# Altium schematic sheet Flight_Controller_v1.SchDoc (part 2 of 2)
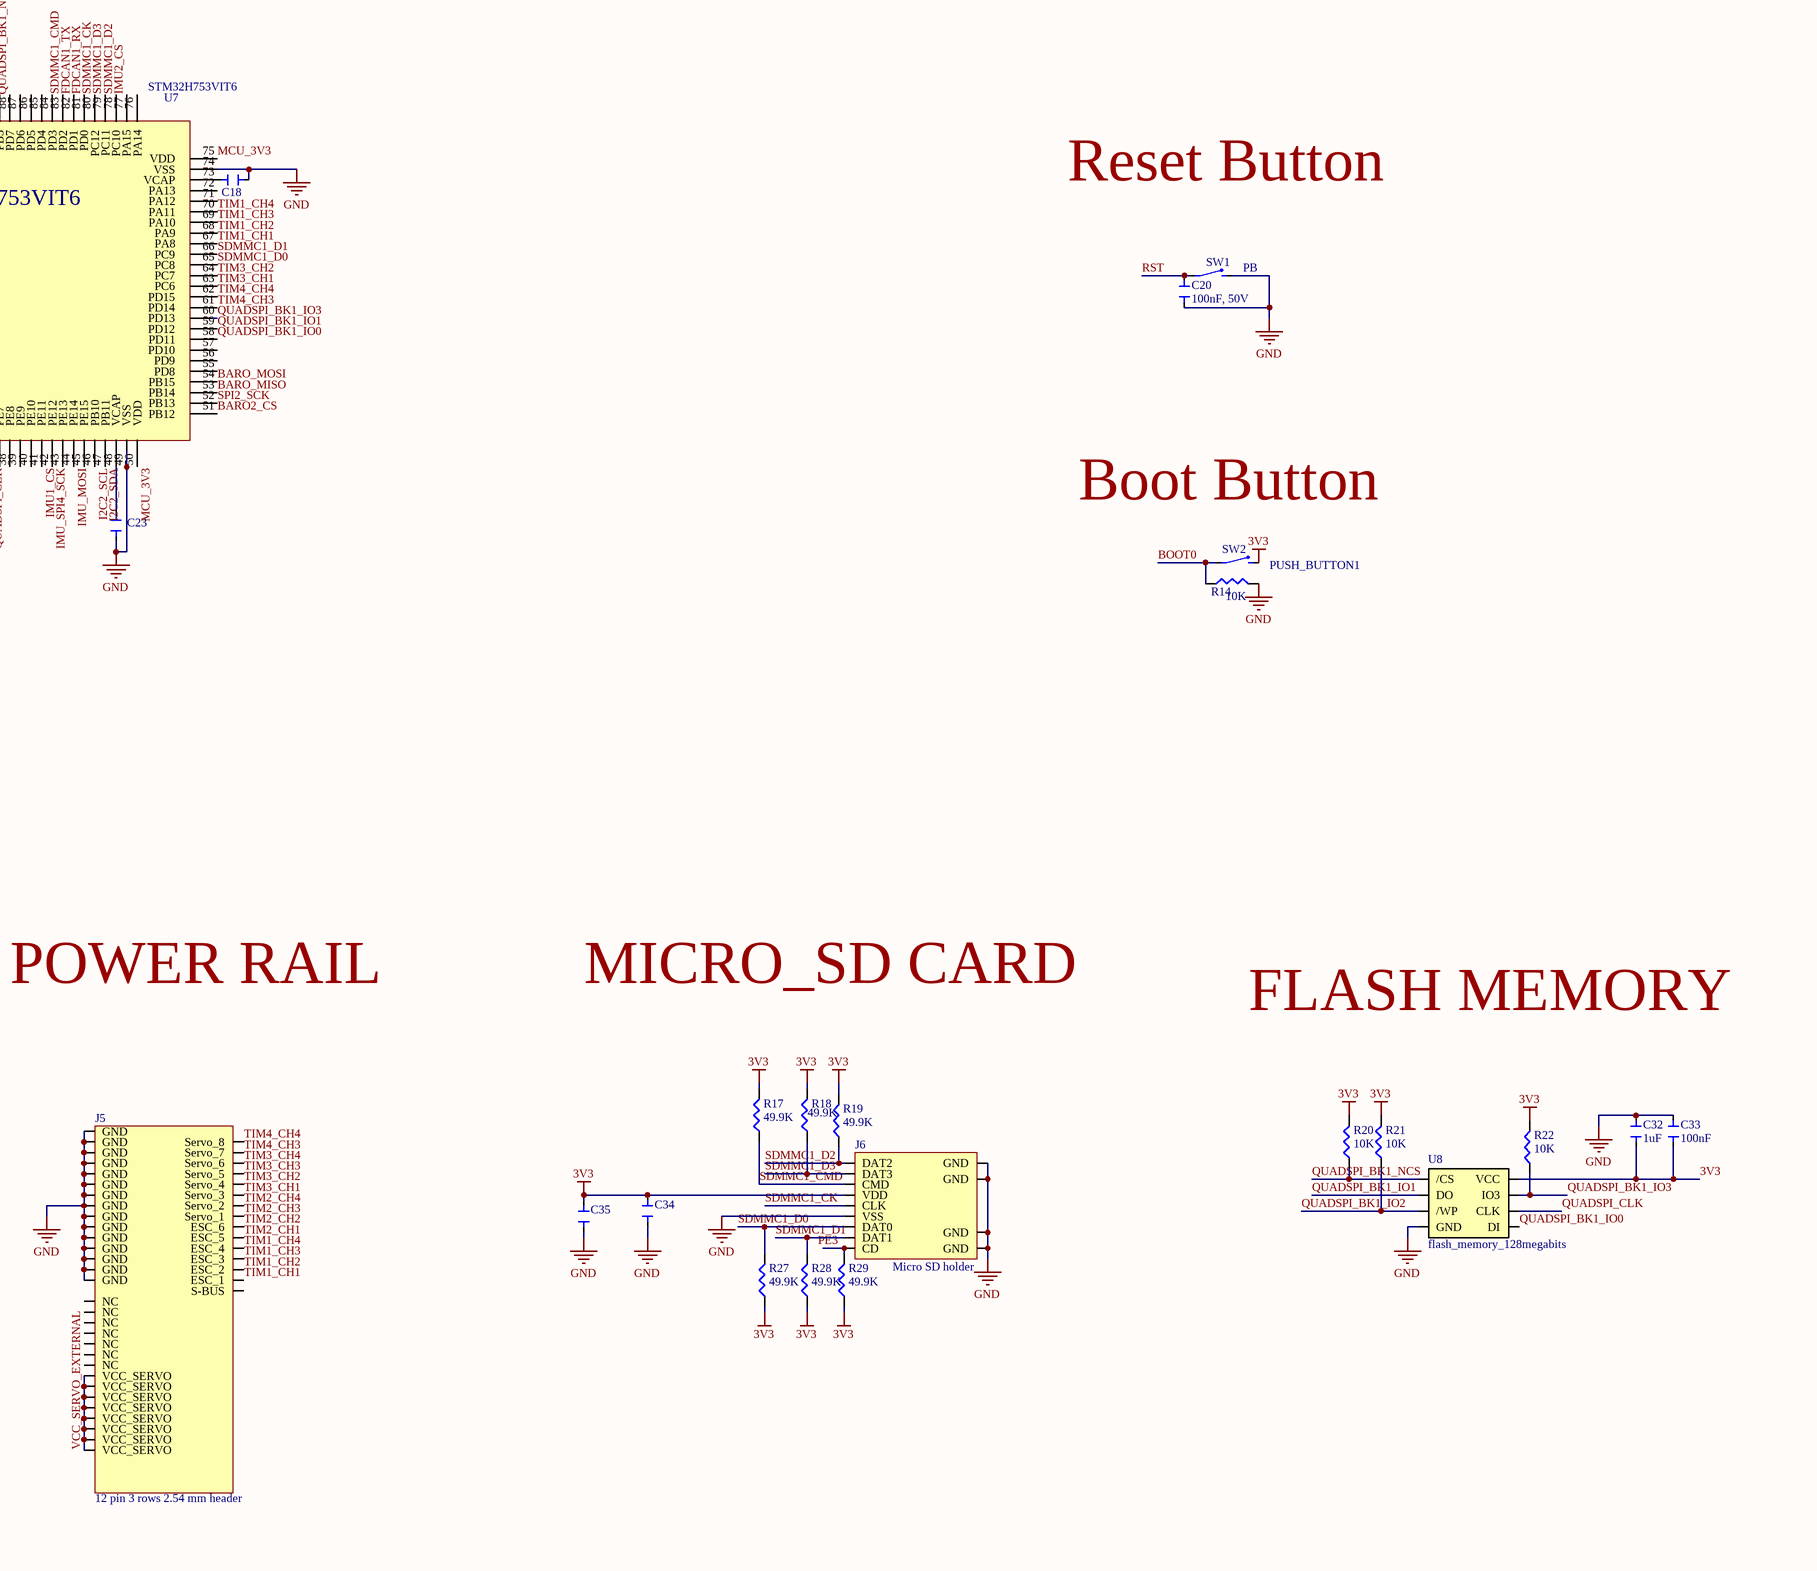
[diagram p4: Flight_Controller_v1.SchDoc, bottom right]

## Library data of the parts
C1 C2 C5-C8 C10-C13 C28 C31 C33 C35-C39 = CAP_100nF: CAP 100nF 50V X7R ±10% 0603 Ceramic Capacitors RoHS; manufacturer: YAGEO; manufacturer part number: CC0603KRX7R9BB104; value: 100nf; supplier: LCSC; supplier part number: C14663; ComponentLink1Description: Datasheet; ComponentLink1URL: https://www.lcsc.com/datasheet/C14663.pdf
C3 C24 C26 C29 = CAP_10uF: CAP 10uF X7R ±10% 1206 Ceramic Capacitors RoHS; manufacturer: TDK; manufacturer part number: CGA5L1X7R1E106K160AC; ComponentLink1Description: Datasheet; ComponentLink1URL: https://www.lcsc.com/datasheet/C2168260.pdf; value: 10uf; supplier: LCSC; supplier part number: C2168260
C4 C16 = CAP_0603_10nf: 10nF ±10% 50V Ceramic Capacitor X7R 0603; ComponentLink1Description: datasheet; ComponentLink1URL: https://www.lcsc.com/product-detail/C100042.html?s_z=n_capacitor%2520%252010nf
C9 C14 C17 C30 C34 = CAP_4.7uF: CAP  4.7uF 25V X7R ±10% 1206 Ceramic Capacitors RoHS; manufacturer: FH; manufacturer part number: 1206B475K250NT; value: 4.7uF; supplier: LCSC; supplier part number: C132148; ComponentLink1Description: Datasheet; ComponentLink1URL: https://www.lcsc.com/product-detail/C132148.html?s_z=n_FH%25201206B475K250N
C15 C25 C27 C40-C43 = CAP_22uF: CAP 22uF 25V X5R ±20% 0805 Ceramic Capacitors RoHS; manufacturer: Samsung Electro-Mechanics; manufacturer part number: CL21A226MAYNNNE; ComponentLink1Description: Datasheet; ComponentLink1URL: https://www.lcsc.com/datasheet/C602037.pdf; Value: 22uF; supplier: LCSC; supplier part number: C602037
C18 C23 = CAP_2.2uF: CAP  2.2uF 25V X7R ±10% 1206 Ceramic Capacitors RoHS; manufacturer: FH; manufacturer part number: 1206B475K250NT; value: 2.2 uF; supplier: LCSC; supplier part number: C132148; ComponentLink1Description: Datasheet; ComponentLink1URL: https://www.lcsc.com/product-detail/C132148.html?s_z=n_FH%25201206B475K250N
C19 C22 = CAP_22pF: 50V 22pF C0G ±5% 0402 Multilayer Ceramic Capacitors MLCC - SMD/SMT ROHS,CAP CER 22pF 50V C0G 0402; Manufacturer: Murata; Manufacturer Part Number: GRM1555C1H220JA01D; Manufacturer Lifecycle Status: NRND; Supplier: Arrow Electronics; Supplier Part Number: GRM1555C1H220JA01D; RoHS: Compliant; Category: Ceramic Capacitors; Stock: 1320000; Pricing: 30000=0.0031 (USD); Value: 22pF; Case/Package: 0402; Case Code (Imperial): 0402; Case Code (Metric): 1005; Depth: 500µm; Dielectric: C0G; Dielectric Material: Ceramic; Height: 500µm; Lead Free: Lead Free; Length: 1mm; Lifecycle Status: NRND; Material: Ceramic; Max Operating Temperature: 125°C; Min Operating Temperature: -55°C; Mounting Technology: Surface Mount; Number of Terminals: 2; Packaging: Cut Tape; Radiation Hardening: No; REACH SVHC: Yes; Schedule B: 8532240020, 8532240020|8532240020|8532240020|8532240020|8532240020; Termination: SMD/SMT; Thickness: 500µm; Tolerance: 5%; Voltage: 50V; Voltage Rating: 50V; Voltage Rating (DC): 50V; Width: 500µm; ComponentLink1URL: https://datasheet.octopart.com:443/GRM1555C1H220JA01D-Murata-datasheet-141913788.pdf?src-supplier=Upverter; ComponentLink1Description: https://datasheet.octopart.com:443/GRM1555C1H220JA01D-Murata-datasheet-141913788.pdf?src-supplier=Upverter; ComponentLink2URL: https://datasheet.octopart.com:443/GRM1555C1H220JA01D-Murata-datasheet-12559435.pdf?src-supplier=element14+APAC; ComponentLink2Description: https://datasheet.octopart.com:443/GRM1555C1H220JA01D-Murata-datasheet-12559435.pdf?src-supplier=element14+APAC; ComponentLink3URL: https://datasheet.octopart.com:443/GRM1555C1H220JA01D-Murata-datasheet-62317060.pdf?src-supplier=element14+APAC; ComponentLink3Description: https://datasheet.octopart.com:443/GRM1555C1H220JA01D-Murata-datasheet-62317060.pdf?src-supplier=element14+APAC; ComponentLink4URL: https://datasheet.octopart.com:443/GRM1555C1H220JA01D-Murata-datasheet-141266224.pdf?src-supplier=Ciiva; ComponentLink4Description: https://datasheet.octopart.com:443/GRM1555C1H220JA01D-Murata-datasheet-141266224.pdf?src-supplier=Ciiva; ComponentLink5URL: https://datasheet.octopart.com:443/GRM1555C1H220JA01D-Murata-datasheet-140681354.pdf?src-supplier=Ciiva; ComponentLink5Description: https://datasheet.octopart.com:443/GRM1555C1H220JA01D-Murata-datasheet-140681354.pdf?src-supplier=Ciiva; ComponentLink6URL: https://datasheet.octopart.com:443/GRM1555C1H220JA01D-Murata-datasheet-138739516.pdf?src-supplier=Ciiva; ComponentLink6Description: https://datasheet.octopart.com:443/GRM1555C1H220JA01D-Murata-datasheet-138739516.pdf?src-supplier=Ciiva; ComponentLink7URL: https://datasheet.octopart.com:443/GRM1555C1H220JA01D-Murata-datasheet-120101189.pdf?src-supplier=Megastar; ComponentLink7Description: https://datasheet.octopart.com:443/GRM1555C1H220JA01D-Murata-datasheet-120101189.pdf?src-supplier=Megastar; ComponentLink8URL: https://datasheet.octopart.com:443/GRM1555C1H220JA01D-Murata-datasheet-81455556.pdf?src-supplier=TME; ComponentLink8Description: https://datasheet.octopart.com:443/GRM1555C1H220JA01D-Murata-datasheet-81455556.pdf?src-supplier=TME; ComponentLink9URL: https://datasheet.octopart.com:443/GRM1555C1H220JA01D-Murata-datasheet-22122223.pdf?src-supplier=Future+Electronics; ComponentLink9Description: https://datasheet.octopart.com:443/GRM1555C1H220JA01D-Murata-datasheet-22122223.pdf?src-supplier=Future+Electronics; ComponentLink10URL: https://datasheet.octopart.com:443/GRM1555C1H220JA01D-Murata-datasheet-12510170.pdf?src-supplier=Future+Electronics; ComponentLink10Description: https://datasheet.octopart.com:443/GRM1555C1H220JA01D-Murata-datasheet-12510170.pdf?src-supplier=Future+Electronics; ComponentLink11URL: https://datasheet.octopart.com:443/GRM1555C1H220JA01D-Murata-datasheet-8517407.pdf?src-supplier=Future+Electronics; ComponentLink11Description: https://datasheet.octopart.com:443/GRM1555C1H220JA01D-Murata-datasheet-8517407.pdf?src-supplier=Future+Electronics; ComponentLink12URL: https://datasheet.octopart.com:443/GRM1555C1H220JA01D-Murata-datasheet-8387045.pdf?src-supplier=Future+Electronics; ComponentLink12Description: https://datasheet.octopart.com:443/GRM1555C1H220JA01D-Murata-datasheet-8387045.pdf?src-supplier=Future+Electronics; ComponentLink13URL: https://datasheet.octopart.com:443/GRM1555C1H220JA01D-Murata-datasheet-8324201.pdf?src-supplier=Future+Electronics; ComponentLink13Description: https://datasheet.octopart.com:443/GRM1555C1H220JA01D-Murata-datasheet-8324201.pdf?src-supplier=Future+Electronics; ComponentLink14URL: https://datasheet.octopart.com:443/GRM1555C1H220JA01D-Murata-datasheet-7628724.pdf?src-supplier=Future+Electronics; ComponentLink14Description: https://datasheet.octopart.com:443/GRM1555C1H220JA01D-Murata-datasheet-7628724.pdf?src-supplier=Future+Electronics; ComponentLink15URL: https://datasheet.octopart.com:443/GRM1555C1H220JA01D-Murata-datasheet-552801.pdf?src-supplier=Future+Electronics; ComponentLink15Description: https://datasheet.octopart.com:443/GRM1555C1H220JA01D-Murata-datasheet-552801.pdf?src-supplier=Future+Electronics; ComponentLink16URL: https://datasheet.octopart.com:443/GRM1555C1H220JA01D-Murata-datasheet-44781475.pdf?src-supplier=Future+Electronics; ComponentLink16Description: https://datasheet.octopart.com:443/GRM1555C1H220JA01D-Murata-datasheet-44781475.pdf?src-supplier=Future+Electronics; ComponentLink17URL: https://datasheet.octopart.com/GRM1555C1H220JA01D-Murata-datasheet-12515295.pdf; ComponentLink17Description: https://datasheet.octopart.com/GRM1555C1H220JA01D-Murata-datasheet-12515295.pdf; ComponentLink18URL: https://datasheet.octopart.com/GRM1555C1H220JA01D-Murata-datasheet-12510076.pdf; ComponentLink18Description: https://datasheet.octopart.com/GRM1555C1H220JA01D-Murata-datasheet-12510076.pdf; ComponentLink19URL: https://datasheet.octopart.com/GRM1555C1H220JA01D-Murata-datasheet-11978611.pdf; ComponentLink19Description: https://datasheet.octopart.com/GRM1555C1H220JA01D-Murata-datasheet-11978611.pdf; ComponentLink20URL: https://datasheet.octopart.com/GRM1555C1H220JA01D-Murata-datasheet-10025737.pdf; ComponentLink20Description: https://datasheet.octopart.com/GRM1555C1H220JA01D-Murata-datasheet-10025737.pdf; ComponentLink21URL: https://datasheet.octopart.com/GRM1555C1H220JA01D-Murata-datasheet-8819587.pdf; ComponentLink21Description: https://datasheet.octopart.com/GRM1555C1H220JA01D-Murata-datasheet-8819587.pdf; ComponentLink22URL: https://datasheet.octopart.com/GRM1555C1H220JA01D-Murata-datasheet-14396388.pdf; ComponentLink22Description: https://datasheet.octopart.com/GRM1555C1H220JA01D-Murata-datasheet-14396388.pdf; ComponentLink23URL: http://sigma.octopart.com:80/reach_statement/Murata-company-16.pdf?src-supplier=Compliance+Statements; ComponentLink23Description: http://sigma.octopart.com:80/reach_statement/Murata-company-16.pdf?src-supplier=Compliance+Statements
C20 = CAP_0402_0.1UF: CAP CER 0.1UF 50V X7R 0402; Manufacturer: Samsung Electro-Mechanics; Manufacturer Part Number: CL05B104KB54PNC; Dielectric Material: Ceramic; Supplier: LCSC; Supplier Part Number: C307331; RoHS: Yes; Category: Ceramic Capacitors; Stock: 1237875; Pricing: 1=0.1, 10=0.044, 50=0.025, 100=0.0194, 500=0.0146, 1000=0.01147, 2500=0.01043, 5000=0.00959 (USD); Pins: 2; Capacitor Type: Ceramic; RoHS Compliant: Yes; Reach SVHC Compliant: Yes; ComponentLink1URL: https://datasheet.ciiva.com:443/pdfs/VipMasterIC/IC/SEMS/SEMS-S-A0006318249/SEMS-S-A0006320959-1.pdf?src-supplier=IHS+Markit; ComponentLink1Description: https://datasheet.ciiva.com:443/pdfs/VipMasterIC/IC/SEMS/SEMS-S-A0006318249/SEMS-S-A0006320959-1.pdf?src-supplier=IHS+Markit; ComponentLink2URL: https://datasheet.octopart.com/CL05B104KB54PNC-Samsung-datasheet-8326407.pdf?src-supplier=TME; ComponentLink2Description: https://datasheet.octopart.com/CL05B104KB54PNC-Samsung-datasheet-8326407.pdf?src-supplier=TME; LCSC Part Number: C307331
C21 = E3SB25E001803E: Crystal 25.0000MHZ 12PF SMD; Manufacturer: Hosonic Electronic; Supplier: DigiKey; Supplier Part Number: 3186-E3SB25E001803ECT-ND; Manufacturer Part Number: E3SB25E001803E; Category: Crystals; Stock: 2953; Pricing: 1=0.34, 10=0.299, 25=0.2824, 50=0.2706, 100=0.2595, 250=0.24536, 500=0.23522, 1000=0.22549 (USD)
C32 = CAP_1uF: CAP  1uF 25V X7R ±10% 1206 Ceramic Capacitors RoHS; manufacturer: FH; manufacturer part number: 1206B475K250NT; value: 2.2 uF; supplier: LCSC; supplier part number: C132148; ComponentLink1Description: Datasheet; ComponentLink1URL: https://www.lcsc.com/product-detail/C132148.html?s_z=n_FH%25201206B475K250N
D1 = ESD5Z5.0: SOD-523 ESD Protection Devices ROHS; Manufacturer: Anbon; Supplier: LCSC; Supplier Part Number: C397782; Manufacturer Part Number: ESD5Z5.0; Category: Uncategorized; Stock: 3000; Pricing: 20=0.0229, 200=0.018, 600=0.0153, 3000=0.012, 9000=0.0106, 21000=0.0099 (USD)
D2 = TVS-bidirectional-Diode: 48.4VC Clamp 4.1A Ipp TVS DIODE SOD-123F; Manufacturer: Littelfuse; Manufacturer Part Number: SMF30CA; Supplier: LCSC; Supplier Part Number: C3720992
D3 = Schottky_40v_3A: Rectifier Diode, Schottky, 1 Phase, 1 Element, 3A, 40V V(RRM), Silicon, DO-214AB; Manufacturer: Vishay; Manufacturer Part Number: SS34-E3/9AT; Element Configuration: Single; Forward Voltage: 500mV; Max Forward Surge Current (Ifsm): 100A; Max Junction Temperature (Tj): 150°C; Max Reverse Leakage Current: 500µA; Number of Elements: 1; Supplier: DigiKey; Supplier Part Number: SS34-E3/9ATGICT-ND; RoHS: Compliant; Category: Rectifier Diodes; Stock: 17685; Pricing: 1=0.78, 10=0.459, 100=0.3295, 500=0.25386, 1000=0.22717 (USD); Average Rectified Current: 3A; Case/Package: SMC; China RoHS: Non-Compliant; Forward Current: 3A; Height: 2.62mm; Lifecycle Status: Production; Max Operating Temperature: 150°C; Max Output current: 3A; Max Repetitive Reverse Voltage (Vrrm): 40V; Max Reverse Voltage (DC): 40V; Max Surge Current: 100A; Min Operating Temperature: -55°C; Mounting Technology: Surface Mount; Pins: 2; Number of Terminals: 2; Peak Non-Repetitive Surge Current: 100A; Peak Reverse Current: 500µA; Radiation Hardening: No; REACH SVHC: No; Reverse Standoff Voltage: 40V; Reverse Voltage: 40V; Schedule B: 8541100080, 8541100080|8541100080|8541100080|8541100080|8541100080; ComponentLink1URL: https://datasheet.octopart.com:443/SS34-E3-9AT-Vishay-datasheet-181475108.pdf?src-supplier=IHS; ComponentLink1Description: https://datasheet.octopart.com:443/SS34-E3-9AT-Vishay-datasheet-181475108.pdf?src-supplier=IHS; ComponentLink2URL: https://datasheet.octopart.com:443/SS34-E3-9AT-Vishay-datasheet-138899081.pdf?src-supplier=Upverter; ComponentLink2Description: https://datasheet.octopart.com:443/SS34-E3-9AT-Vishay-datasheet-138899081.pdf?src-supplier=Upverter; ComponentLink3URL: https://datasheet.octopart.com:443/SS34-E3-9AT-Vishay-datasheet-188933186.pdf?src-supplier=TME; ComponentLink3Description: https://datasheet.octopart.com:443/SS34-E3-9AT-Vishay-datasheet-188933186.pdf?src-supplier=TME; ComponentLink4URL: https://datasheet.octopart.com:443/SS34-E3-9AT-Vishay-datasheet-15599040.pdf?src-supplier=Future+Electronics; ComponentLink4Description: https://datasheet.octopart.com:443/SS34-E3-9AT-Vishay-datasheet-15599040.pdf?src-supplier=Future+Electronics; ComponentLink5URL: https://datasheet.octopart.com:443/SS34-E3/9AT-Vishay-datasheet-11610764.pdf?src-supplier=Arrow+Electronics; ComponentLink5Description: https://datasheet.octopart.com:443/SS34-E3/9AT-Vishay-datasheet-11610764.pdf?src-supplier=Arrow+Electronics; ComponentLink6URL: http://sigma.octopart.com:80/rohs_statement/Vishay-company-15.pdf?src-supplier=Compliance+Statements; ComponentLink6Description: http://sigma.octopart.com:80/rohs_statement/Vishay-company-15.pdf?src-supplier=Compliance+Statements
D4-D6 = AQ3045-01ETG: TVS DIODE 5.3VWM 12VC SOD882; Manufacturer: Littelfuse; Diode Element Material: SILICON; Package Body Material: Plastic; Polarity: Bidirectional; Max Breakdown Voltage: 9V; Min Breakdown Voltage: 6.8V; Diode Type: TRANS VOLTAGE SUPPRESSOR; Non-rep Peak Rev Power Dis-Max: 40W; Number of Elements: 1; Rep Pk Reverse Voltage-Max: 5.3V; Reference Standard: AEC-Q101; Supplier: Digikey; Supplier Part Number: F9321CT-ND; Manufacturer Part Number: AQ3045-01ETG; RoHS: Yes; Category: TVS Diodes; Stock: 21664; Pricing: 1=0.5, 10=0.391, 100=0.2344, 500=0.217, 1000=0.14756, 2000=0.13585, 5000=0.1302 (USD); Pins: 2; Package Shape: Rectangular; Min Operating Temperature: -55°C; Max Operating Temperature: 150°C; Package Style: CHIP CARRIERMeter; Surface Mount: Yes; Technology: AVALANCHE; Terminal Form: No Lead; Terminal Position: BOTTOM; Reach SVHC Compliant: Yes; RoHS Compliant: Yes; ComponentLink1URL: https://datasheet.ciiva.com:443/pdfs/VipMasterIC/IC/LFSI/LFSI-S-A0007892042/LFSI-S-A0007892042-1.pdf?src-supplier=IHS+Markit; ComponentLink1Description: https://datasheet.ciiva.com:443/pdfs/VipMasterIC/IC/LFSI/LFSI-S-A0007892042/LFSI-S-A0007892042-1.pdf?src-supplier=IHS+Markit; ComponentLink2URL: https://www.littelfuse.com/~/media/electronics/datasheets/tvs_diode_arrays/littelfuse_tvs_diode_array_aq3045_datasheet.pdf.pdf?src-supplier=Digikey; ComponentLink2Description: https://www.littelfuse.com/~/media/electronics/datasheets/tvs_diode_arrays/littelfuse_tvs_diode_array_aq3045_datasheet.pdf.pdf?src-supplier=Digikey; ComponentLink3URL: http://www.littelfuse.com/~/media/electronics/datasheets/tvs_diode_arrays/littelfuse_tvs_diode_array_aq3045_datasheet.pdf.pdf?src-supplier=Digikey; ComponentLink3Description: http://www.littelfuse.com/~/media/electronics/datasheets/tvs_diode_arrays/littelfuse_tvs_diode_array_aq3045_datasheet.pdf.pdf?src-supplier=Digikey; LCSC Part Number: C3710326
F1 = 0451020.MRL: 125V 3A 2410 Fuses RoHS; Manufacturer: Littelfuse; Fuse Interrupt Ac Current: 50A; Fuse I2T: 1.65A2Sec; Fuse Blow Speed: Fast; Voltage Rating: 125V; LCSC link: https://www.lcsc.com/product-detail/C13982.html?s_z=n_0451003.MRL; Max Fuse Dc Voltage: 125V; Mouser Description: Surface Mount Fuses 125V 3A; Package: 0451; Device Class L2: Fuses; Fuse Current: 3A; Manufacturer Part Number: 0451020.MRL; ComponentLink2Description: Datasheet; Lead Free: Yes; Temperature Range Low: -55°C; Max Fuse Ac Voltage: 125V; Temperature: -55°C to +125°C; Device Class L1: Circuit Protection; Octopart: https://octopart.com/0451003.mrl-littelfuse-566380; Category: Fuse; Height: 2.94mm; Temperature Range High: +125°C; Supplier Part Number: C178980; ComponentLink2URL: https://www.littelfuse.com/~/media/electronics/datasheets/fuses/littelfuse_fuse_451_453_datasheet.pdf.pdf; Digikey Description: FUSE BRD MNT 3A 125VAC/VDC 2SMD; Device Class L3: unset; Supplier: LCSC; Fuse Interrupt Dc Current: 50A; LCSC Part: C13982; Datasheet Link: https://www.lcsc.com/datasheet/C178980.pdf
I1 I2 = BLM18SG121TN1D: Ferrite Beads Multi-Layer 120Ohm 25% 10Kyocera KNH16C104DA5TS EMI filter0MHz 3A 0.025Ohm DCR 0603 T/R; Manufacturer: Murata; Current Rating: 1A; DC Resistance (DCR): 25mΩ; Frequency: 100MHz; Impedance: 120Ω; Number of Circuits: 1; Value: 25mΩ; Shielding: Unshielded; Supplier: Arrow Electronics; Supplier Part Number: C107332; Manufacturer Part Number: BLM18SG121TN1D; RoHS: Compliant; Category: Ferrite Beads and Chips; Stock: 330000; Pricing: 10000=0.0271 (USD); Case/Package: 0603; Case Code (Imperial): 0603; Case Code (Metric): 1608; Contact Plating: Tin; Core Material: Ferrite; Depth: 800µm; Height: 500µm; Lead Free: Lead Free; Length: 1.6mm; Lifecycle Status: Production; Material: Ferrite, Steel; Max Current Rating: 3A; Max DC Current: 3A; Clock Frequency: 100MHz; Max Operating Temperature: 125°C; Min Operating Temperature: -55°C; Number of Lines: 1; Pins: 2; Number of Terminals: 2; Packaging: Cut Tape; REACH SVHC: Yes; RMS Current (Irms): 3A; Schedule B: 8504500000, 8504500000|8504500000|8504500000|8504500000|8504500000; ESR: 25mΩ; Termination: SMD/SMT; Test Frequency: 100MHz; Tolerance: 25%; Width: 800µm; ComponentLink1URL: https://datasheet.octopart.com:443/BLM18SG121TN1D-Murata-datasheet-180806579.pdf?src-supplier=IHS; ComponentLink1Description: https://datasheet.octopart.com:443/BLM18SG121TN1D-Murata-datasheet-180806579.pdf?src-supplier=IHS; ComponentLink2URL: https://datasheet.octopart.com:443/BLM18SG121TN1D-Murata-datasheet-37129980.pdf?src-supplier=element14+APAC; ComponentLink2Description: https://datasheet.octopart.com:443/BLM18SG121TN1D-Murata-datasheet-37129980.pdf?src-supplier=element14+APAC; ComponentLink3URL: https://datasheet.octopart.com:443/BLM18SG121TN1D-Murata-datasheet-168152.pdf?src-supplier=element14+APAC; ComponentLink3Description: https://datasheet.octopart.com:443/BLM18SG121TN1D-Murata-datasheet-168152.pdf?src-supplier=element14+APAC; ComponentLink4URL: https://datasheet.octopart.com:443/BLM18SG121TN1D-Murata-datasheet-11549175.pdf?src-supplier=_legacy+Avnet; ComponentLink4Description: https://datasheet.octopart.com:443/BLM18SG121TN1D-Murata-datasheet-11549175.pdf?src-supplier=_legacy+Avnet; ComponentLink5URL: https://datasheet.octopart.com:443/BLM18SG121TN1D-Murata-datasheet-55943.pdf?src-supplier=DigiKey; ComponentLink5Description: https://datasheet.octopart.com:443/BLM18SG121TN1D-Murata-datasheet-55943.pdf?src-supplier=DigiKey; ComponentLink6URL: https://datasheet.octopart.com:443/BLM18SG121TN1D-Murata-datasheet-141258064.pdf?src-supplier=Ciiva; ComponentLink6Description: https://datasheet.octopart.com:443/BLM18SG121TN1D-Murata-datasheet-141258064.pdf?src-supplier=Ciiva; ComponentLink7URL: https://datasheet.octopart.com:443/BLM18SG121TN1D-Murata-datasheet-138707216.pdf?src-supplier=Ciiva; ComponentLink7Description: https://datasheet.octopart.com:443/BLM18SG121TN1D-Murata-datasheet-138707216.pdf?src-supplier=Ciiva; ComponentLink8URL: https://datasheet.octopart.com:443/BLM18SG121TN1D-Murata-datasheet-135086704.pdf?src-supplier=TME; ComponentLink8Description: https://datasheet.octopart.com:443/BLM18SG121TN1D-Murata-datasheet-135086704.pdf?src-supplier=TME; ComponentLink9URL: https://datasheet.octopart.com:443/BLM18SG121TN1D-Murata-datasheet-62086350.pdf?src-supplier=Future+Electronics; ComponentLink9Description: https://datasheet.octopart.com:443/BLM18SG121TN1D-Murata-datasheet-62086350.pdf?src-supplier=Future+Electronics; ComponentLink10URL: https://datasheet.octopart.com:443/BLM18SG121TN1D-Murata-datasheet-12522583.pdf?src-supplier=Newark; ComponentLink10Description: https://datasheet.octopart.com:443/BLM18SG121TN1D-Murata-datasheet-12522583.pdf?src-supplier=Newark; ComponentLink11URL: https://datasheet.octopart.com:443/BLM18SG121TN1D-Murata-datasheet-10083551.pdf?src-supplier=Newark; ComponentLink11Description: https://datasheet.octopart.com:443/BLM18SG121TN1D-Murata-datasheet-10083551.pdf?src-supplier=Newark; ComponentLink12URL: https://datasheet.octopart.com:443/BLM18SG121TN1D-Murata-datasheet-8508678.pdf?src-supplier=Newark; ComponentLink12Description: https://datasheet.octopart.com:443/BLM18SG121TN1D-Murata-datasheet-8508678.pdf?src-supplier=Newark; ComponentLink13URL: http://sigma.octopart.com:80/reach_statement/Murata-company-16.pdf?src-supplier=Compliance+Statements; ComponentLink13Description: http://sigma.octopart.com:80/reach_statement/Murata-company-16.pdf?src-supplier=Compliance+Statements
J1 = XT30PW-M: Manufacturer: Changzhou Amass Elec; Manufacturer Part Number: XT30U-M; Supplier: LCSC; Supplier Part Number: C99101; Datasheet Link: https://www.lcsc.com/datasheet/C99101.pdf
J4 = USB_C: USB Connector, USB Type C, USB 2.0, Receptacle, 16 Ways, Surface Mount, Through Hole Mount; Manufacturer: Molex; Manufacturer Part Number: 217179-0001; Contact Resistance: 50mΩ; Current Rating: 1.25A; Dielectric Material: Polyamide; Insulation Resistance: 100MΩ; Number of Contacts: 16; Number of Ports: 1; USB Standard: USB 2.0; Voltage Rating: 30V; Supplier: LCSC; Supplier Part Number: C3197684; RoHS: Compliant; Category: USB Connectors; Stock: 3219; Pricing: 1=0.6714, 10=0.617, 25=0.573, 50=0.562, 100=0.534, 250=0.511, 500=0.477, 1200=0.432, 2400=0.399 (USD); Contact Gender: Female; Contact Material: Gold, Nickel; Gender: Receptacle; Height: 3.36mm; Lifecycle Status: Production; Max Operating Temperature: 85°C; Min Operating Temperature: -40°C; Pins: 16; Number of Rows: 1; REACH SVHC: Yes; Shell Finish: Nickel; Shell Material: Stainless Steel; Terminal Pitch: 500µm; ComponentLink1URL: https://datasheet.octopart.com:443/217179-0001-Molex-datasheet-158871109.pdf?src-supplier=ODG+(Origin+Data+Global); ComponentLink1Description: https://datasheet.octopart.com:443/217179-0001-Molex-datasheet-158871109.pdf?src-supplier=ODG+(Origin+Data+Global); ComponentLink2URL: https://sigma.octopart.com:443/158871110/technical_drawing/Molex-217179-0001.pdf?src-supplier=Upverter; ComponentLink2Description: https://sigma.octopart.com:443/158871110/technical_drawing/Molex-217179-0001.pdf?src-supplier=Upverter; ComponentLink3URL: https://datasheet.octopart.com:443/217179-0001-Molex-datasheet-164573281.pdf?src-supplier=RS+(Formerly+Allied+Electronics); ComponentLink3Description: https://datasheet.octopart.com:443/217179-0001-Molex-datasheet-164573281.pdf?src-supplier=RS+(Formerly+Allied+Electronics); ComponentLink4URL: http://sigma.octopart.com:80/reach_statement/Molex-company-74.pdf?src-supplier=Compliance+Statements; ComponentLink4Description: http://sigma.octopart.com:80/reach_statement/Molex-company-74.pdf?src-supplier=Compliance+Statements; ComponentLink5URL: http://sigma.octopart.com:80/rohs_statement/Molex-company-73.pdf?src-supplier=Compliance+Statements; ComponentLink5Description: http://sigma.octopart.com:80/rohs_statement/Molex-company-73.pdf?src-supplier=Compliance+Statements; ComponentLink6URL: http://sigma.octopart.com:80/conflict_mineral_statement/Molex-company-72.pdf?src-supplier=Compliance+Statements; ComponentLink6Description: http://sigma.octopart.com:80/conflict_mineral_statement/Molex-company-72.pdf?src-supplier=Compliance+Statements; LCSC NUMBER: C3197684
J5 = servo_pwr_rail_1: Pin Header, Board-to-Board, 2.54 mm, 3 Rows, 45 Contacts, Through Hole Right Angle, TSW Series; Manufacturer: Samtec; Manufacturer Part Number: TSW-115-08-G-T-RA; Manufacturer Lifecycle Status: PRODUCTION; Gender: Male; Max Current Rating: 7.6A; Max Voltage Rating (AC): 450V; Number of Contacts: 45; Pitch: 2.54mm; Supplier: LCSC; Supplier Part Number: C374878; RoHS: Compliant; Category: Headers and Wire Housings; Stock: 30; Pricing: 1=61.0933, 1=6.6606, 1=7.6558, 1=55.8108, 10=52.5507, 10=5.7293, 10=48.0069, 10=6.5853, 30=5.1613, 30=47.3414, 30=43.248, 30=5.9325, 100=39.256, 100=4.6849, 100=42.9715, 100=5.3849 (HKD); Contact Material: Bronze; Contact Plating: Gold, Tin; Depth: 14.98mm; Housing Color: Black; Housing Material: Polyester; Lead Pitch: 2.54mm; Length: 38.1mm; Lifecycle Status: Production; Max Operating Temperature: 125°C; Min Operating Temperature: -55°C; Number of Rows: 3; Orientation: Right Angle; Packaging: Bulk; REACH SVHC: No; Termination: Solder; ComponentLink1URL: https://sigma.octopart.com:443/97325577/technical_drawing/Samtec-TSW-115-08-G-T-RA.pdf?src-supplier=Samtec; ComponentLink1Description: https://sigma.octopart.com:443/97325577/technical_drawing/Samtec-TSW-115-08-G-T-RA.pdf?src-supplier=Samtec; ComponentLink2URL: https://datasheet.octopart.com:443/TSW-115-08-G-T-RA-Samtec-datasheet-150856372.pdf?src-supplier=Electro+Sonic; ComponentLink2Description: https://datasheet.octopart.com:443/TSW-115-08-G-T-RA-Samtec-datasheet-150856372.pdf?src-supplier=Electro+Sonic; ComponentLink3URL: https://datasheet.octopart.com:443/TSW-115-08-G-T-RA-Samtec-datasheet-136646178.pdf?src-supplier=Electro+Sonic; ComponentLink3Description: https://datasheet.octopart.com:443/TSW-115-08-G-T-RA-Samtec-datasheet-136646178.pdf?src-supplier=Electro+Sonic; ComponentLink4URL: https://datasheet.octopart.com:443/TSW-115-08-G-T-RA-Samtec-datasheet-62107121.pdf?src-supplier=Farnell; ComponentLink4Description: https://datasheet.octopart.com:443/TSW-115-08-G-T-RA-Samtec-datasheet-62107121.pdf?src-supplier=Farnell; ComponentLink5URL: https://datasheet.octopart.com:443/TSW-115-08-G-T-RA-Samtec-datasheet-180258786.pdf?src-supplier=JRH+Electronics; ComponentLink5Description: https://datasheet.octopart.com:443/TSW-115-08-G-T-RA-Samtec-datasheet-180258786.pdf?src-supplier=JRH+Electronics; ComponentLink6URL: https://datasheet.octopart.com:443/TSW-115-08-G-T-RA-Samtec-datasheet-151455181.pdf?src-supplier=Sager+Electronics; ComponentLink6Description: https://datasheet.octopart.com:443/TSW-115-08-G-T-RA-Samtec-datasheet-151455181.pdf?src-supplier=Sager+Electronics; ComponentLink7URL: https://datasheet.octopart.com/TSW-115-08-G-T-RA-Samtec-datasheet-86818365.pdf; ComponentLink7Description: https://datasheet.octopart.com/TSW-115-08-G-T-RA-Samtec-datasheet-86818365.pdf; ComponentLink8URL: https://datasheet.octopart.com:443/TSW-115-08-G-T-RA-Samtec-datasheet-11047283.pdf?src-supplier=Newark; ComponentLink8Description: https://datasheet.octopart.com:443/TSW-115-08-G-T-RA-Samtec-datasheet-11047283.pdf?src-supplier=Newark
J6 = TF-CARD H1.8 SY: -40⊥~+70⊥ 2mm Gold Card Slot MicroSD card (TF card) Copper alloy Self-bouncing SMD SD Card / Memory Card Connector ROHS; Manufacturer: SHOU HAN; Supplier: LCSC; Supplier Part Number: C7529391; Manufacturer Part Number: TF-CARD H1.8 SY; Category: Memory Cards; Stock: 12390; Pricing: 10=0.483, 10=0.4412, 10=0.0606, 10=0.0528, 100=0.3471, 100=0.0476, 100=0.3799, 100=0.0415, 300=0.3291, 300=0.3006, 300=0.036, 300=0.0413, 1000=0.273, 1000=0.0326, 1000=0.0375, 1000=0.2988, 5000=0.2677, 5000=0.0293, 5000=0.2446, 5000=0.0336, 10000=0.2526, 10000=0.2307, 10000=0.0276, 10000=0.0317 (HKD)
L1 = IND_12.3_22uH: 22uH Magnetic Shielded Inductor 7A SMD,12.3x12.3mm Fixed Inductors RoHS
P1 P2 P4 P5 = JST_GH_V4: BM04B-GHS-TBT; Supplier 1: Digi-Key
P3 = JST_GH_V3: BM03B-GHS-TBT; Supplier 1: Digi-Key
Q1 = AO4407A: 3.1W 38mΩ@5V,10A SOIC-8 Single FETs, MOSFETs RoHS; SnapEDA_Link: https://www.snapeda.com/parts/AO4407A/Alpha/view-part/?ref=snap; Package: SOIC-8; LCSC Link: https://www.lcsc.com/product-detail/C16072.html?s_z=n_AO4407A; LCSC Part: C16072; MP: AO4407A
R1 R2 = RES_0603_3.9K: Resistor, / 100mW 3.9kΩ 75V ±100ppm/℃ Thick Film Resistor ±1% 0603 Chip Resistor - Surface Mount RoHS; manufacturer: UNI-ROYAL; Manufacturer part number: 0603WAF3901T5E; ComponentLink1Description: Datasheet; ComponentLink1URL: https://www.lcsc.com/datasheet/C23018.pdf; value: 3.9k; supplier: LCSC; supplier part number: C23018
R3 R15 R16 R23 R26 = RES_0402_0R: RES 0 OHM JUMPER 1/16W 0402; Manufacturer: Yageo; Manufacturer Part Number: RC0402JR-070RL; Power: 62.5mW; Rated Temperature: 70°C; Package Height: 0.35mm; Package Length: 1mm; Package Width: 0.5mm; Supplier: LCSC; Supplier Part Number: C60485; RoHS: Yes; Category: Chip SMD Resistors; Stock: 5988729; Pricing: 1=0.1, 10=0.011, 25=0.0084, 50=0.0064, 100=0.0045, 250=0.00364, 500=0.0029, 1000=0.00214, 5000=0.00154 (USD); Mounting Technology: Surface Mount; Pins: 2; Package Shape: Rectangular; Case/Package: 0402; Terminal Finish: Nickel; Min Operating Temperature: -55°C; Max Operating Temperature: 155°C; JESD-609 Code: e3; Resistor Type: FIXED RESISTOR; Construction: Chip; Package Style: SMTMeter; Packaging: Tape and Reel; Value: 0R; Technology: METAL GLAZE/THICK FILM; Termination: Wraparound; Reach SVHC Compliant: Yes; RoHS Compliant: Yes; ComponentLink1URL: https://datasheet.ciiva.com:443/pdfs/VipMasterIC/IC/YAGO/YAGO-S-A0008145938/YAGO-S-A0008145938-1.pdf?src-supplier=IHS+Markit; ComponentLink1Description: https://datasheet.ciiva.com:443/pdfs/VipMasterIC/IC/YAGO/YAGO-S-A0008145938/YAGO-S-A0008145938-1.pdf?src-supplier=IHS+Markit; LCSC Part Number: C60485
R4 R14 R20-R22 R30 R34 = RES_0402_10K: RES SMD 10K OHM 1% 1/16W 0402; Manufacturer: Yageo; Manufacturer Part Number: AC0402FR-0710KL; Additional Feature: LASER TRIMMABLE; Power: 62.5mW; Rated Temperature: 70°C; Value: 10kR; Temperature Coefficient: 100ppm/°C; Working Voltage: 50V; Package Height: 0.32mm; Package Length: 1mm; Package Width: 0.5mm; Reference Standard: AEC-Q200; Supplier: LCSC; Supplier Part Number: C144807; RoHS: Yes; Category: Chip SMD Resistors; Stock: 1122213; Pricing: 1=0.1, 10=0.019, 50=0.0116, 100=0.0095, 500=0.00638, 1000=0.00544, 5000=0.00391 (USD); Mounting Technology: Surface Mount; Pins: 2; Package Shape: Rectangular; Case/Package: 0402; Terminal Finish: Nickel; Min Operating Temperature: -55°C; Max Operating Temperature: 155°C; Tolerance: 1%; JESD-609 Code: e3; Resistor Type: FIXED RESISTOR; Construction: Chip; Package Style: SMTMeter; Packaging: Tape and Reel; Technology: METAL GLAZE/THICK FILM; Termination: Wraparound; Reach SVHC Compliant: Yes; RoHS Compliant: Yes; ComponentLink1URL: https://datasheet.ciiva.com:443/pdfs/VipMasterIC/IC/YAGO/YAGO-S-A0003597364/YAGO-S-A0003597364-1.pdf?src-supplier=IHS+Markit; ComponentLink1Description: https://datasheet.ciiva.com:443/pdfs/VipMasterIC/IC/YAGO/YAGO-S-A0003597364/YAGO-S-A0003597364-1.pdf?src-supplier=IHS+Markit; ComponentLink2URL: https://datasheet.ciiva.com/12656/pyu-ac-51-rohs-l-2-12656634.pdf?src-supplier=Mouser; ComponentLink2Description: https://datasheet.ciiva.com/12656/pyu-ac-51-rohs-l-2-12656634.pdf?src-supplier=Mouser; LCSC Part Number: C144807
R5 R8 R17-R19 R27-R29 = RES_0603_49.9K: 49.9kΩ ±1% 100mW 0603 Thick Film Resistor; Manufacturer: FOJAN; Manufacturer Part Number: FRC0603F4992TS; Supplier: LCSC; Supplier Part Number: C2930109
R6 = RES_0402_9.2K: 9.2kΩ 63mW 50V Thin Film Resistor ±25ppm/℃ ±0.1% 0402 Chip Resistor - Surface Mount RoHS; ComponentLink1Description: datasheet; ComponentLink1URL: https://www.lcsc.com/product-detail/C852968.html?s_z=n_resistance%25209.2K
R7 R10 R11 = RES_0603_23.7K: 23.7kΩ ±1% 100mW 0603 Thick Film Resistor; VALUE: 23.7K; POWER: 100mW; ComponentLink1Description: datasheet; ComponentLink1URL: https://www.lcsc.com/product-detail/C22912.html?s_z=n_resistance%252023.7k%2520
R9 R13 R32 R33 = RES_0402_5.1K: RES SMD 5.1K OHM 1% 1/16W 0402; Manufacturer: Yageo; Manufacturer Part Number: AC0402FR-075K1L; Additional Feature: LASER TRIMMABLE; Power: 62.5mW; Rated Temperature: 70°C; Value: 5.1kR; Temperature Coefficient: 100ppm/°C; Working Voltage: 50V; Package Height: 0.32mm; Package Length: 1mm; Package Width: 0.5mm; Reference Standard: AEC-Q200; Supplier: LCSC; Supplier Part Number: C144745; RoHS: Yes; Category: Chip SMD Resistors; Stock: 164969; Pricing: 1=0.1, 10=0.019, 50=0.0116, 100=0.0095, 500=0.00638, 1000=0.00544, 5000=0.00391 (USD); Mounting Technology: Surface Mount; Pins: 2; Package Shape: Rectangular; Case/Package: 0402; Terminal Finish: Nickel; Min Operating Temperature: -55°C; Max Operating Temperature: 155°C; Tolerance: 1%; JESD-609 Code: e3; Resistor Type: FIXED RESISTOR; Construction: Chip; Package Style: SMTMeter; Packaging: Tape and Reel; Technology: METAL GLAZE/THICK FILM; Termination: Wraparound; Reach SVHC Compliant: Yes; RoHS Compliant: Yes; ComponentLink1URL: https://datasheet.ciiva.com:443/pdfs/VipMasterIC/IC/YAGO/YAGO-S-A0003597364/YAGO-S-A0003597364-1.pdf?src-supplier=IHS+Markit; ComponentLink1Description: https://datasheet.ciiva.com:443/pdfs/VipMasterIC/IC/YAGO/YAGO-S-A0003597364/YAGO-S-A0003597364-1.pdf?src-supplier=IHS+Markit; ComponentLink2URL: https://datasheet.octopart.com/AC0402FR-075K1L-Yageo-datasheet-166720450.pdf?src-supplier=Future+Electronics; ComponentLink2Description: https://datasheet.octopart.com/AC0402FR-075K1L-Yageo-datasheet-166720450.pdf?src-supplier=Future+Electronics; ComponentLink3URL: http://www.yageo.com/documents/recent/PYu-AC_51_RoHS_L_2_revised.pdf?src-supplier=Future+Electronics; ComponentLink3Description: http://www.yageo.com/documents/recent/PYu-AC_51_RoHS_L_2_revised.pdf?src-supplier=Future+Electronics; LCSC Part Number: C144745
R12 = RES_0603_51.1K: 51.1kΩ ±0.1% 100mW 0603 Thin Film Resistor AEC-Q200; ComponentLink1Description: Datasheet; ComponentLink1URL: https://www.lcsc.com/product-detail/C491138.html?s_z=n_resistance%252051.1k%2520
R24 R25 = RES_0402_27R: RES 27 OHM 1% 1/16W 0402; Manufacturer: Yageo; Manufacturer Part Number: RC0402FR-0727RL; Additional Feature: LASER TRIMMABLE; Power: 62.5mW; Rated Temperature: 70°C; Temperature Coefficient: 100ppm/°C; Working Voltage: 50V; Package Height: 0.35mm; Package Length: 1mm; Package Width: 0.5mm; SPL: C138021; Supplier: LCSC; RoHS: Yes; Category: Chip SMD Resistors; Stock: 423061; Pricing: 1=0.1, 10=0.015, 50=0.0088, 100=0.0073, 500=0.00488, 1000=0.00417, 5000=0.00297 (USD); Mounting Technology: Surface Mount; Pins: 2; Package Shape: Rectangular; Case/Package: 0402; Terminal Finish: Nickel; Min Operating Temperature: -55°C; Max Operating Temperature: 155°C; Tolerance: 1%; JESD-609 Code: e3; Resistor Type: FIXED RESISTOR; Construction: Chip; Package Style: SMTMeter; Packaging: Tape and Reel; Value: 27R; Technology: METAL GLAZE/THICK FILM; Termination: Wraparound; Reach SVHC Compliant: Yes; RoHS Compliant: Yes; ComponentLink1URL: https://datasheet.ciiva.com:443/pdfs/VipMasterIC/IC/YAGO/YAGO-S-A0008145938/YAGO-S-A0008145938-1.pdf?src-supplier=IHS+Markit; ComponentLink1Description: https://datasheet.ciiva.com:443/pdfs/VipMasterIC/IC/YAGO/YAGO-S-A0008145938/YAGO-S-A0008145938-1.pdf?src-supplier=IHS+Markit; ComponentLink2URL: https://datasheet.ciiva.com/11808/0900766b80c66297-11808450.pdf?src-supplier=Rs; ComponentLink2Description: https://datasheet.ciiva.com/11808/0900766b80c66297-11808450.pdf?src-supplier=Rs; ComponentLink3URL: https://datasheet.ciiva.com/7849/1018594-7849927.pdf?src-supplier=Element14; ComponentLink3Description: https://datasheet.ciiva.com/7849/1018594-7849927.pdf?src-supplier=Element14; ComponentLink4URL: https://datasheet.ciiva.com/7849/1018594-7849926.pdf?src-supplier=Element14; ComponentLink4Description: https://datasheet.ciiva.com/7849/1018594-7849926.pdf?src-supplier=Element14; Supplier Part Number: C138021
R31 = RES_0402_4.7K: RES 4.7K OHM 1% 1/16W 0402; Manufacturer: Yageo; Manufacturer Part Number: RC0402FR-074K7L; Additional Feature: LASER TRIMMABLE; Power: 62.5mW; Rated Temperature: 70°C; Value: 4.7kR; Temperature Coefficient: 100ppm/°C; Working Voltage: 50V; Package Height: 0.35mm; Package Length: 1mm; Package Width: 0.5mm; Supplier: LCSC; Supplier Part Number: C105871; RoHS: Yes; Category: Chip SMD Resistors; Stock: 9886878; Pricing: 1=0.1, 10=0.015, 50=0.0088, 100=0.0073, 500=0.00488, 1000=0.00417, 5000=0.00297 (USD); Mounting Technology: Surface Mount; Pins: 2; Package Shape: Rectangular; Case/Package: 0402; Terminal Finish: Nickel; Min Operating Temperature: -55°C; Max Operating Temperature: 155°C; Tolerance: 1%; JESD-609 Code: e3; Resistor Type: FIXED RESISTOR; Construction: Chip; Package Style: SMTMeter; Packaging: Tape and Reel; Technology: METAL GLAZE/THICK FILM; Termination: Wraparound; Reach SVHC Compliant: Yes; RoHS Compliant: Yes; ComponentLink1URL: https://datasheet.ciiva.com:443/pdfs/VipMasterIC/IC/YAGO/YAGO-S-A0008145938/YAGO-S-A0008145938-1.pdf?src-supplier=IHS+Markit; ComponentLink1Description: https://datasheet.ciiva.com:443/pdfs/VipMasterIC/IC/YAGO/YAGO-S-A0008145938/YAGO-S-A0008145938-1.pdf?src-supplier=IHS+Markit; ComponentLink2URL: https://datasheet.ciiva.com/22661/1686128-22661342.pdf?src-supplier=Element14; ComponentLink2Description: https://datasheet.ciiva.com/22661/1686128-22661342.pdf?src-supplier=Element14; ComponentLink3URL: https://datasheet.ciiva.com/7850/1018594-7850022.pdf?src-supplier=Element14; ComponentLink3Description: https://datasheet.ciiva.com/7850/1018594-7850022.pdf?src-supplier=Element14; ComponentLink4URL: https://datasheet.ciiva.com/7850/1018594-7850023.pdf?src-supplier=Element14; ComponentLink4Description: https://datasheet.ciiva.com/7850/1018594-7850023.pdf?src-supplier=Element14; ComponentLink5URL: https://datasheet.ciiva.com/15215/getdatasheetpartid-328119-15215035.pdf?src-supplier=Verical; ComponentLink5Description: https://datasheet.ciiva.com/15215/getdatasheetpartid-328119-15215035.pdf?src-supplier=Verical; LCSC Part Number: C105871
SW1 SW2 = PUSH_BUTTON1: Manufacturer: XUNPU; Manufacturer Part Number: TS-1088-AR02016; Supplier: LCSC; Supplier Part Number: C720477; Datasheet: https://www.lcsc.com/datasheet/C720477.pdf
U1 = ICM-42688-P: Accelerometer Gyroscope LGA-14(2.5x3) IMUs (Inertial Measurement Units) RoHS; Manufacturer: TDK InvenSense; Manufacturer Part Number: ICM-42688-P; Supplier: LCSC; Supplier Part Number: C1850418
U2 = MPU-6000: Accelerometer Gyroscope QFN-24-EP(4x4) Accelerometers RoHS; Manufacturer: TDK InvenSense; Manufacturer Part Number: MPU-6000; Supplier: LCSC; Supplier Part Number: C92401
U3 = AOZ1282CI: Converter DC/DC; buck; Vout: 0.8-30V; Vin: 4.5-36V; 1.2A; 0.45MHz; -40+85 deg.C; SMD; SOT23; Manufacturer: Alpha & Omega Semiconductor; Frequency: 450kHz; Max Duty Cycle: 87%; Max Input Voltage: 36V; Max Junction Temperature (Tj): 150°C; Max Switching Frequency: 540kHz; Min Input Voltage: 4.5V; Min Output Voltage: 800mV; Nominal Input Voltage: 12V; Nominal Supply Current: 1mA; Number of Circuits: 1; Output Configuration: Positive; Output Type: Adjustable; Synchronous Rectifier: No; Supplier 1: DigiKey; Manufacturer Part Number: AOZ1282CI; RoHS: Compliant; Category: Voltage Regulators - Switching; Stock 1: 13583; Pricing 1: 1=1.04, 10=0.751, 25=0.678, 100=0.5979, 250=0.55972, 500=0.53664, 1000=0.51767 (USD); Ambient Temperature Range High: 85°C; Case/Package: SOT-23-6; Height: 1.25mm; Height - Seated (Max): 1.25mm; Lead Free: Lead Free; Length: 2.9mm; Lifecycle Status: Production; Max Operating Temperature: 85°C; Max Output Current: 1.2A; Max Output Voltage: 36V; Max Supply Voltage: 36V; Min Operating Temperature: -40°C; Min Supply Voltage: 4.5V; Mount: Surface Mount; Number of Outputs: 1; Number of Pins: 6; Number of Terminals: 6; Output Current: 1.2A; Output Voltage: 36V; Packaging: Digi-Reel®; REACH SVHC: Yes; Schedule B: 8542390000, 8542390000|8542390000|8542390000|8542390000|8542390000; Switching Frequency: 450kHz; Terminal Pitch: 950µm; Topology: Buck; Width: 1.6mm; ComponentLink1URL: https://datasheet.octopart.com:443/AOZ1282CI-Alpha-%26-Omega-Semiconductor-datasheet-182233402.pdf?src-supplier=IHS; ComponentLink1Description: https://datasheet.octopart.com:443/AOZ1282CI-Alpha-%26-Omega-Semiconductor-datasheet-182233402.pdf?src-supplier=IHS; ComponentLink2URL: https://datasheet.octopart.com:443/AOZ1282CI-Alpha-%26-Omega-Semiconductor-datasheet-67314984.pdf?src-supplier=ODG+(Origin+Data+Global); ComponentLink2Description: https://datasheet.octopart.com:443/AOZ1282CI-Alpha-%26-Omega-Semiconductor-datasheet-67314984.pdf?src-supplier=ODG+(Origin+Data+Global); ComponentLink3URL: https://sigma.octopart.com:443/138895817/technical_drawing/Alpha-%26-Omega-Semiconductor-AOZ1282CI.pdf?src-supplier=Upverter; ComponentLink3Description: https://sigma.octopart.com:443/138895817/technical_drawing/Alpha-%26-Omega-Semiconductor-AOZ1282CI.pdf?src-supplier=Upverter; ComponentLink4URL: https://datasheet.octopart.com:443/AOZ1282CI-Alpha-%26-Omega-Semiconductor-datasheet-188851037.pdf?src-supplier=TME; ComponentLink4Description: https://datasheet.octopart.com:443/AOZ1282CI-Alpha-%26-Omega-Semiconductor-datasheet-188851037.pdf?src-supplier=TME; ComponentLink5URL: https://sigma.octopart.com:443/142346442/technical_drawing/Alpha-%26-Omega-Semiconductor-AOZ1282CI.pdf?src-supplier=Alpha+%26+Omega+Semiconductor+SCT; ComponentLink5Description: https://sigma.octopart.com:443/142346442/technical_drawing/Alpha-%26-Omega-Semiconductor-AOZ1282CI.pdf?src-supplier=Alpha+%26+Omega+Semiconductor+SCT; ComponentLink6URL: https://datasheet.octopart.com/AOZ1282CI-Alpha-%26-Omega-Semiconductor-datasheet-47864051.pdf; ComponentLink6Description: https://datasheet.octopart.com/AOZ1282CI-Alpha-%26-Omega-Semiconductor-datasheet-47864051.pdf; Supplier Part Number 1: 785-1613-1-ND
U4 = BMP388: 30Kpa~1.25bar LGA-10(2x2) Pressure Sensors, Transducers RoHS; Manufacturer: Bosch; Manufacturer Part Number: BMP388; Supplier: LCSC; Supplier Part Number: C779278
U5 = BMP280: 30Kpa~1.1bar LGA-8(2x2.5) Pressure Sensors, Transducers RoHS; Manufacturer: Bosch; Manufacturer Part Number: BMP280; Supplier: LCSC; Supplier Part Number: C83291
U6 = TI TPS2121RUXT___: 2.8V~22V 2 VQFN-HR-12(2x2.5) OR Controllers, Ideal Diodes RoHS; Manufacturer: TI; Mfr. Part: TPS2121RUXT; LCSC Part: C2156025; Package: VQFN-HR-12(2x2.5); LCSC Link: https://www.lcsc.com/product-detail/C2156025.html?s_z=n_TPS2121
U8 = 128Mb_FLASH: NOR Flash Serial (SPI, Dual SPI, Quad SPI) 3.3V 128M-bit 16M x 8 6ns 8-Pin SOIC Tube; Manufacturer: Winbond; Manufacturer Part Number: W25Q128JVSIQ; Frequency: 104MHz; Clock Frequency: 133MHz; Max Supply Current: 20mA; Max Supply Voltage: 3.6V; Memory Size: 16MB; Min Supply Voltage: 2.7V; Number of Circuits: 1; Operating Supply Voltage: 3V; Supplier: LCSC; Supplier Part Number: C97521; RoHS: Compliant; Category: Flash; Stock: 16290; Pricing: 1=1.97, 10=1.846, 25=1.7932, 90=1.71878, 180=1.6785, 270=1.65493, 540=1.61485, 1080=1.57507, 5040=1.48849 (USD); Ambient Temperature Range High: 85°C; Case/Package: SOIC; China RoHS: Compliant; Height: 2.16mm; Height - Seated (Max): 2.16mm; Interface: Serial; Length: 5.23mm; Lifecycle Status: Production; Max Operating Temperature: 85°C; Memory Format: FLASH; Min Operating Temperature: -40°C; Number of Terminals: 8; REACH SVHC: Yes; Schedule B: 8542320070, 8542320070|8542320070, 8542320070|8542320070|8542320070, 8542320070|8542320070|8542320070|8542320070; Terminal Pitch: 1.27mm; Width: 5.23mm; ComponentLink1URL: https://datasheet.octopart.com:443/W25Q128JVSIQ-Winbond-datasheet-181529389.pdf?src-supplier=ODG+(Origin+Data+Global); ComponentLink1Description: https://datasheet.octopart.com:443/W25Q128JVSIQ-Winbond-datasheet-181529389.pdf?src-supplier=ODG+(Origin+Data+Global); ComponentLink2URL: https://sigma.octopart.com:443/138898685/technical_drawing/Winbond-W25Q128JVSIQ.pdf?src-supplier=Upverter; ComponentLink2Description: https://sigma.octopart.com:443/138898685/technical_drawing/Winbond-W25Q128JVSIQ.pdf?src-supplier=Upverter; ComponentLink3URL: https://datasheet.octopart.com:443/W25Q128JVSIQ-Winbond-datasheet-138898757.pdf?src-supplier=Upverter; ComponentLink3Description: https://datasheet.octopart.com:443/W25Q128JVSIQ-Winbond-datasheet-138898757.pdf?src-supplier=Upverter; ComponentLink4URL: https://datasheet.octopart.com:443/W25Q128JVSIQ-Winbond-datasheet-138104337.pdf?src-supplier=Augswan; ComponentLink4Description: https://datasheet.octopart.com:443/W25Q128JVSIQ-Winbond-datasheet-138104337.pdf?src-supplier=Augswan
U9 = FT231XQ-R: IC USB SERIAL FULL UART 20QFN; Manufacturer: FTDI; Power Supplies: 3.3/5V; Max Supply Current: 8.4mA; Max Supply Voltage: 5.5V; Min Supply Voltage: 2.97V; Nominal Supply Voltage: 5V; Qualification Status: Not Qualified; Supplier: LCSC; Supplier Part Number: C132159; Manufacturer Part Number: FT231XQ-R; RoHS: Yes; Category: Interface ICs; Stock: 77572; Pricing: 1=2.34, 25=2.27, 100=2.2, 250=2, 500=1.82002, 1000=1.7625 (USD); Case/Package: HVQCCN; Pins: 20; Package Shape: Square; Min Operating Temperature: -40°C; Max Operating Temperature: 85°C; JESD-30 Code: S-XQCC-N20; Package Style: CHIP CARRIER, HEAT SINK/SLUG, VERY THIN PROFILEMeter; Surface Mount: Yes; Technology: CMOS; Terminal Form: No Lead; Terminal Position: QUAD; Length: 4mm; Width: 4mm; Height - Seated (Max): 0.8mm; Terminal Pitch: 0.5mm; Temperature Grade: INDUSTRIAL; Reach SVHC Compliant: Yes; RoHS Compliant: Yes; ComponentLink1URL: https://datasheet.ciiva.com:443/pdfs/VipMasterIC/IC/FTDI/FTDIS00099/FTDIS00099-1.pdf?src-supplier=IHS+Markit; ComponentLink1Description: https://datasheet.ciiva.com:443/pdfs/VipMasterIC/IC/FTDI/FTDIS00099/FTDIS00099-1.pdf?src-supplier=IHS+Markit; ComponentLink2URL: https://datasheet.ciiva.com/1787/ds-ft231x-1787312.pdf?src-supplier=Digikey; ComponentLink2Description: https://datasheet.ciiva.com/1787/ds-ft231x-1787312.pdf?src-supplier=Digikey; ComponentLink3URL: https://datasheet.ciiva.com/4787/ds-ft231x-13571-4787570.pdf?src-supplier=Mouser; ComponentLink3Description: https://datasheet.ciiva.com/4787/ds-ft231x-13571-4787570.pdf?src-supplier=Mouser; ComponentLink4URL: https://datasheet.ciiva.com/30475/0900766b811020d3-30475405.pdf?src-supplier=Rs; ComponentLink4Description: https://datasheet.ciiva.com/30475/0900766b811020d3-30475405.pdf?src-supplier=Rs; ComponentLink5URL: https://datasheet.ciiva.com/1787/ft-x-series-1787313.pdf?src-supplier=Digikey; ComponentLink5Description: https://datasheet.ciiva.com/1787/ft-x-series-1787313.pdf?src-supplier=Digikey; ComponentLink6URL: https://datasheet.ciiva.com/1787/ft-x-series-1787314.pdf?src-supplier=Digikey; ComponentLink6Description: https://datasheet.ciiva.com/1787/ft-x-series-1787314.pdf?src-supplier=Digikey; LCSC Part Number: C132159
U10 U11 = AMS1117-3.3: Gull Wing EAR99 Fixed Positive Single Output Ldo Regulator Dual Voltage Regulator Linear 125C 1.2W 1A 1.8MM; Manufacturer: Advanced Monolithic Systems; Dropout Voltage: 1.1V; Max Supply Voltage: 15V; Max Junction Temperature (Tj): 125°C; Nominal Supply Current: 5mA; Number of Outputs: 1; Output Voltage: 3.3V; Supplier: LCSC; Supplier Part Number: C6186; Manufacturer Part Number: AMS1117-3.3; RoHS: Compliant; Category: Voltage Regulators - Linear; Stock: 747810; Pricing: 5=1.3215, 5=1.2073, 5=0.1656, 5=0.1441, 50=0.9186, 50=0.126, 50=1.0055, 50=0.1097, 150=0.8507, 150=0.7772, 150=0.0928, 150=0.1066, 500=0.651, 500=0.0777, 500=0.0893, 500=0.7127, 2500=0.6744, 2500=0.0736, 2500=0.6161, 2500=0.0845, 5000=0.652, 5000=0.5956, 5000=0.0711, 5000=0.0817 (HKD); Case/Package: SOT-223; Height: 1.8mm; Max Operating Temperature: 125°C; Max Power Dissipation: 1.2W; Min Operating Temperature: -40°C; Pins: 2; Output Current: 1A; ComponentLink1URL: https://datasheet.octopart.com:443/AMS1117-3.3-Advanced-Monolithic-Systems-datasheet-31830847.pdf?src-supplier=Upverter; ComponentLink1Description: https://datasheet.octopart.com:443/AMS1117-3.3-Advanced-Monolithic-Systems-datasheet-31830847.pdf?src-supplier=Upverter